# EAGLE design th-lora (EAGLE 6.5.0)
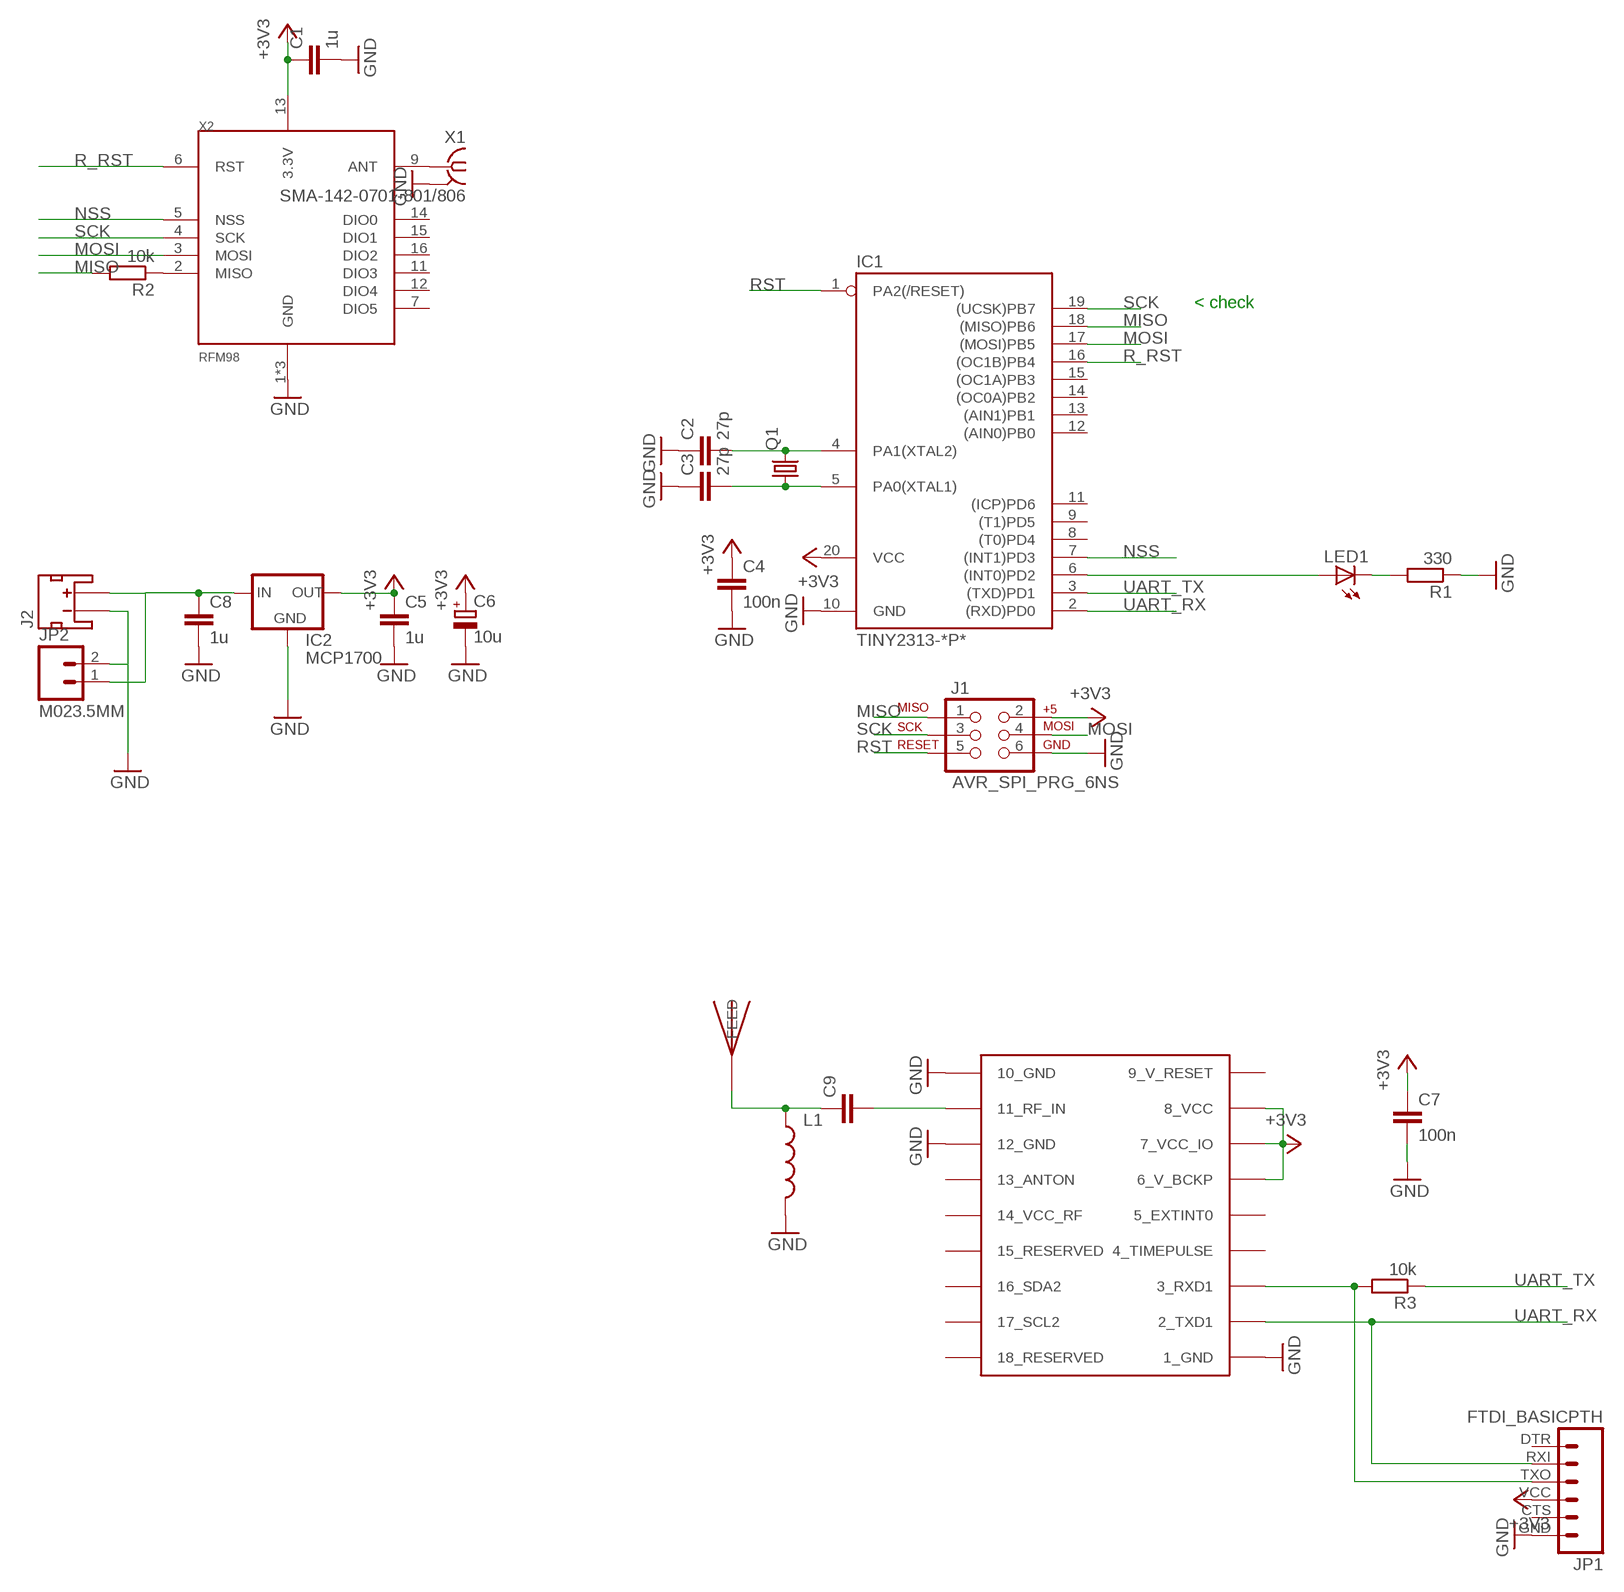
[diagram p0: schematic, sheet 1]

## Parts
C1  1u  C-EU050-025X075  [C050-025X075]
C2  27p  C-EU050-025X075  [C050-025X075]
C3  27p  C-EU050-025X075  [C050-025X075]
C4  100n  C-EU050-025X075  [C050-025X075]
C5  1u  C-EU050-025X075  [C050-025X075]
C6  10u  CPOL-EUE2.5-5  [E2,5-5]
C7  100n  C-EU050-025X075  [C050-025X075]
C8  1u  C-EU050-025X075  [C050-025X075]
C9  C-EUC0603  [C0603]
IC1  TINY2313-*P*  [DIL20]
IC2  MCP1700  [TO92-INLINE]
J1  AVR_SPI_PRG_6NS  [2X3-NS]
J2  JST_2MM_MALE  [JST-2-SMD]
JP1  FTDI_BASICPTH  [FTDI_BASIC]
JP2  M023.5MM  [SCREWTERMINAL-3.5MM-2]
L1  INDUCTOR0603  [0603]
LED1  LED3MM  [LED3MM]
Q1  CRYSTALHC49S  [HC49/S]
R1  330  R-EU_0204/7  [0204/7]
R2  10k  R-EU_0204/7  [0204/7]
R3  10k  R-EU_0204/7  [0204/7]
U$3  JTI_ANTENNA-1575AT43A40  [JTI_ANTENNA-1575AT43A40]
X1  SMA-142-0701-801/806  [J502-ND-142-0701-801/806]
X2  RFM98  [RFM97]
X3  UBLOX_MAX  [UBLOX_MAX]

## Nets
+3V3: C1.1 C4.1 C5.1 C6.+ C7.1 IC1.20(VCC) IC2.VOUT(OUT) J1.2 JP1.VCC X2.13(3.3V) X3.6_V_BCKP X3.7_VCC_IO X3.8_VCC
GND: C1.2 C2.1 C3.1 C4.2 C5.2 C6.- C7.2 C8.2 IC1.10(GND) IC2.GND J1.6 J2.1(-) JP1.GND JP2.2 L1.2 R1.1 X1.G@1 X1.G@2 X1.G@3 X1.G@4 X2.1(GND) X2.8(GND) X2.10(GND) X3.1_GND X3.10_GND X3.12_GND
MISO: IC1.18((MISO)PB6) J1.1 R2.2
MOSI: IC1.17((MOSI)PB5) J1.4 X2.3(MOSI)
N$1: C9.2 X3.11_RF_IN
N$2: X1.1 X2.9(ANT)
N$3: LED1.K(C) R1.2
N$4: C9.1 L1.1 U$3.FEED
N$6: C2.2 IC1.4(PA1(XTAL2)) Q1.2
N$7: C3.2 IC1.5(PA0(XTAL1)) Q1.1
N$11: C8.1 IC2.VIN(IN) J2.2(+) JP2.1
N$12: IC1.6((INT0)PD2) LED1.A
N$13: JP1.TXO R3.2 X3.3_RXD1
N$14: R2.1 X2.2(MISO)
NSS: IC1.7((INT1)PD3) X2.5(NSS)
R_RST: IC1.16((OC1B)PB4) X2.6(RST)
RST: IC1.1(PA2(/RESET)) J1.5
SCK: IC1.19((UCSK)PB7) J1.3 X2.4(SCK)
UART_RX: IC1.2((RXD)PD0) JP1.RXI X3.2_TXD1
UART_TX: IC1.3((TXD)PD1) R3.1
Unconnected: IC1.8((T0)PD4) IC1.9((T1)PD5) IC1.11((ICP)PD6) IC1.12((AIN0)PB0) IC1.13((AIN1)PB1) IC1.14((OC0A)PB2) IC1.15((OC1A)PB3) J2.NC1(PAD1) J2.NC2(PAD2) JP1.CTS JP1.DTR X2.7(DIO5) X2.11(DIO3) X2.12(DIO4) X2.14(DIO0) X2.15(DIO1) X2.16(DIO2) X3.4_TIMEPULSE X3.5_EXTINT0 X3.13_ANTON X3.14_VCC_RF X3.15_RESERVED X3.16_SDA2 X3.17_SCL2 X3.18_RESERVED

## Notes on the sheet
- < check

## Power pins joined to a net without a drawn wire
9_V_RESET: X3.9_V_RESET

## Library data of the parts
C1-C5 C7-C9 = rcl:C-EU: CAPACITOR, European symbol
C6 = rcl:CPOL-EU: POLARIZED CAPACITOR, European symbol
IC1 = avr-7:TINY2313*: Atmel Tiny2313 2K Flash, 128 bytes EEPROM, 128 bytes RAM
IC2 = dtb:MCP1700
J1 = SparkFun-Connectors:AVR_SPI_PRG_6: AVR ISP 6 Pin This is the reduced ISP connector for AVR programming. Common on Arduino. This footprint will take up less PCB space and can be used with a 10-pin to 6-pin adapter such as SKU: BOB-08508
J2 = dtb:JST_2MM_MALE: Mates to single-cell LiPo batteries. CONN-08352; PROD_ID: CONN-08352
JP1 = SparkFun-Connectors:FTDI_BASIC: FTDI Basic header with labels
JP2 = SparkFun-Connectors:M02: Standard 2-pin 0.1" header. Use with - straight break away headers ( PRT-00116) - right angle break away headers (PRT-00553) - swiss pins (PRT-00743) - machine pins (PRT-00117) - female headers (PRT-00115) Molex polarized connector foot print use with: PRT-08233 with associated crimp pins and housings. 2.54_SCREWTERM for use with PRT-10571. 3.5mm Screw Terminal footprints for PRT-08084 5mm Screw Terminal footprints for use with PRT-08433
L1 = SparkFun-Passives:INDUCTOR: Inductors Basic Inductor/Choke - 0603 and 1206. Footprints are not proven and vary greatly between part numbers. SRN6045- 33uH, 20% 1.4A SDR0403-560KL - 56uH, 10%, 500mA RMS/740mA peak
LED1 = dtb:LED: LED OSRAM: - CHIPLED LG R971, LG N971, LY N971, LG Q971, LY Q971, LO R971, LY R971 LH N974, LH R974 LS Q976, LO Q976, LY Q976 LO Q996 - Hyper CHIPLED LW Q18S LB Q993, LB Q99A, LB R99A - SideLED LS A670, LO A670, LY A670, LG A670, LP A670 LB A673, LV A673, LT A673, LW A673 LH A674 LY A675 LS A676, LA A676, LO A676, LY A676, LW A676 LS A679, LY A679, LG A679 - Hyper Micro SIDELED® LS Y876, LA Y876, LO Y876, LY Y876 LT Y87S - SmartLED LW L88C, LW L88S LB L89C, LB L89S, LG L890 LS L89K, LO L89K, LY L89K LS L896, LA L896, LO L896, LY L896 - TOPLED LS T670, LO T670, LY T670, LG T670, LP T670 LSG T670, LSP T670, LSY T670, LOP T670, LYG T670 LG T671, LOG T671, LSG T671 LB T673, LV T673, LT T673, LW T673 LH T674 LS T676, LA T676, LO T676, LY T676, LB T676, LH T676, LSB T676, LW T676 LB T67C, LV T67C, LT T67C, LS T67K, LO T67K, LY T67K, LW E67C LS E67B, LA E67B, LO E67B, LY E67B, LB E67C, LV E67C, LT E67C LW T67C LS T679, LY T679, LG T679 LS T770, LO T770, LY T770, LG T770, LP T770 LB T773, LV T773, LT T773, LW T773 LH T774 LS E675, LA E675, LY E675, LS T675 LS T776, LA T776, LO T776, LY T776, LB T776 LHGB T686 LT T68C, LB T68C - Hyper Mini TOPLED® LB M676 - Mini TOPLED Santana® LG M470 LS M47K, LO M47K, LY M47K Source: http://www.osram.convergy.de LUXEON: - LUMILED® LXK2-PW12-R00, LXK2-PW12-S00, LXK2-PW14-U00, LXK2-PW14-V00 LXK2-PM12-R00, LXK2-PM12-S00, LXK2-PM14-U00 LXK2-PE12-Q00, LXK2-PE12-R00, LXK2-PE12-S00, LXK2-PE14-T00, LXK2-PE14-U00 LXK2-PB12-K00, LXK2-PB12-L00, LXK2-PB12-M00, LXK2-PB14-N00, LXK2-PB14-P00, LXK2-PB14-Q00 LXK2-PR12-L00, LXK2-PR12-M00, LXK2-PR14-Q00, LXK2-PR14-R00 LXK2-PD12-Q00, LXK2-PD12-R00, LXK2-PD12-S00 LXK2-PH12-R00, LXK2-PH12-S00 LXK2-PL12-P00, LXK2-PL12-Q00, LXK2-PL12-R00 Source: www.luxeon.com KINGBRIGHT: KA-3528ASYC Source: www.kingbright.com
Q1 = crystal:CRYSTAL: CRYSTAL; OC_FARNELL: 1667008; OC_NEWARK: unknown
R1-R3 = rcl:R-EU_: RESISTOR, European symbol
U$3 = Ava:JTI_ANTENNA-1575AT43A40
X1 = con-coax:SMA-: SMA 50 Ohm End Launch Jack Receptacle - Round Contact Johnson Components Source: www.johnsoncomponents.com .. J502-ND.pdf; MF: JOHNSON COMPONENTS; MPN: 142-0701-801; OC_FARNELL: 1608592; OC_NEWARK: 90F2624
X2 = Mine:RFM98
X3 = Ava:UBLOX_MAX: UBLOX MAX

## Board
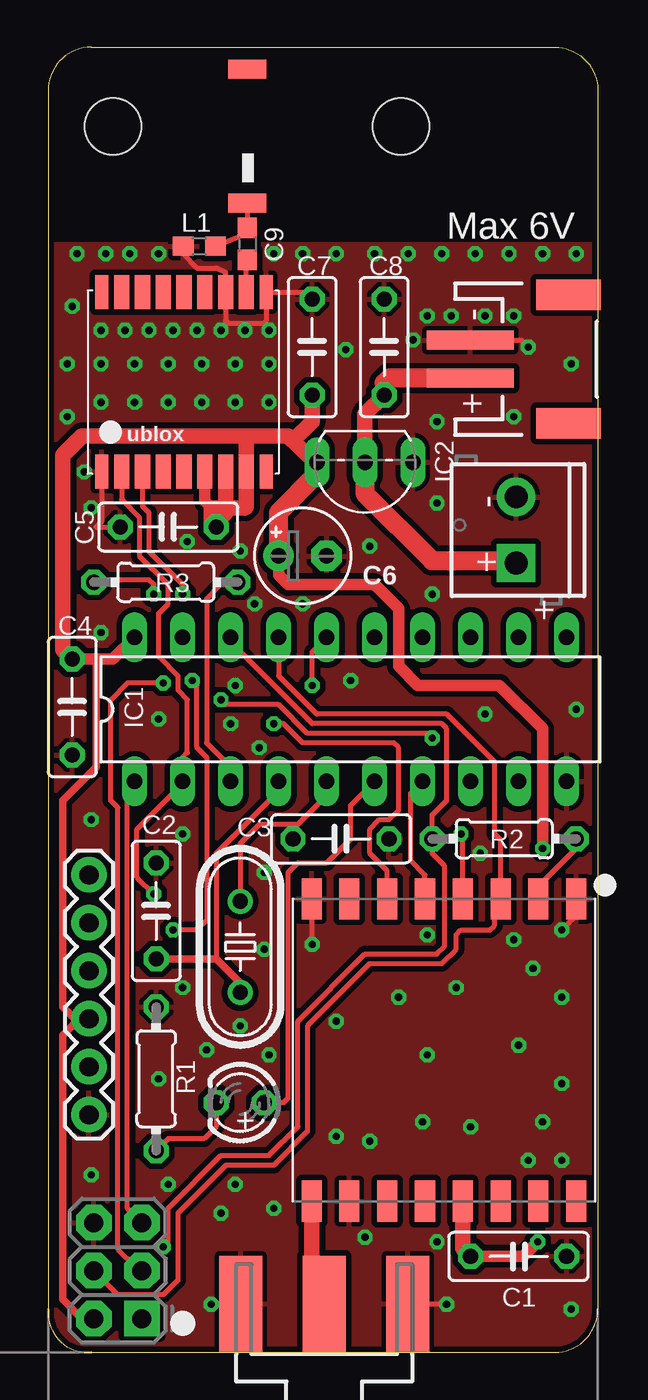
[diagram p1: board, top side]
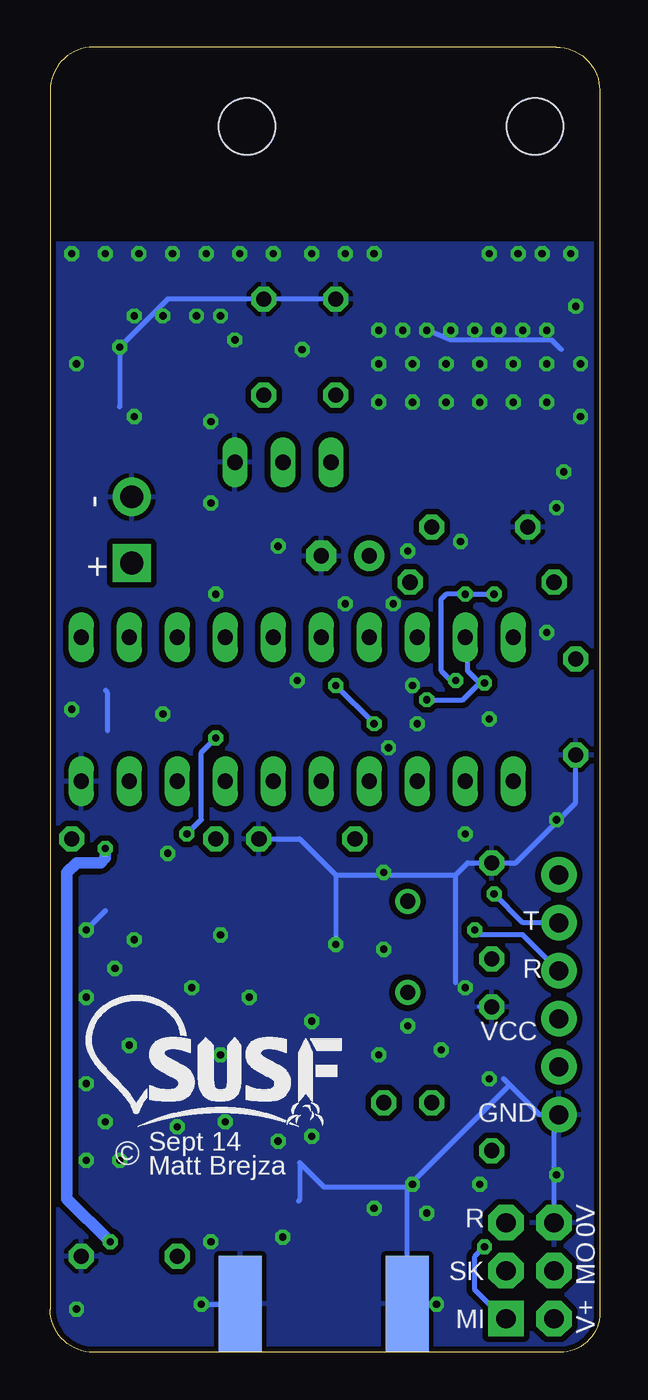
[diagram p2: board, bottom side, seen from below]

Size 29.09 x 69.09 mm. Coordinates in mm from the lower left corner, seen from the top.
Outline: 1.91,0 26.81,0 arc90 29.09,2.29 29.09,66.8 arc90 26.81,69.09 2.29,69.09 arc90 0.01,66.8 0.01,2.29 arc90 1.91,0
Copper layers (1*16): Top 0.035mm / dielectric 1.5mm / Bottom 0.035mm
Design rules "default *": minimum track width 8mil, minimum drill 15mil, track to track 8mil, track to pad 8mil, pad to pad 6mil, via to via 8mil, smd to smd 6mil, copper to edge 10mil, drill to drill 8mil, minimum pad ring 10mil, minimum via ring 8mil, stop-mask expansion 4mil, vias tented up to drill 15mil, thermal gap 10mil
Holes 3 mm at 18.68,64.9 3.44,64.9

### Footprints (pad centres in the part's own frame; a part is rotated, then mirrored left to right if it is on the bottom)
C050-025X075 = drill 0.813 octagon: 1 -2.54,0; 2 2.54,0
E2,5-5 = drill 0.813 pad 1.6: + -1.27,0 | drill 0.813 pad 1.6 octagon: - 1.27,0
C0603 = smd 1.1 x 1: 1 -0.85,0; 2 0.85,0
DIL20 = drill 0.813 long: 1 -11.43,-3.81; 2 -8.89,-3.81; 3 -6.35,-3.81; 4 -3.81,-3.81; 5 -1.27,-3.81; 6 1.27,-3.81; 7 3.81,-3.81; 8 6.35,-3.81; 9 8.89,-3.81; 10 11.43,-3.81; 11 11.43,3.81; 12 8.89,3.81; 13 6.35,3.81; 14 3.81,3.81; 15 1.27,3.81; 16 -1.27,3.81; 17 -3.81,3.81; 18 -6.35,3.81; 19 -8.89,3.81; 20 -11.43,3.81
TO92-INLINE = drill 0.813 long: GND -2.54,0; VIN 0,0; VOUT 2.54,0
2X3-NS = drill 1.016 pad 1.88 square: 1 -2.54,-1.27 | drill 1.016 pad 1.88 octagon: 2 -2.54,1.27; 3 0,-1.27; 4 0,1.27; 5 2.54,-1.27; 6 2.54,1.27
JST-2-SMD = smd 1 x 4.6: 1 -1,-3.7; 2 1,-3.7 | smd 1.6 x 3.4: NC1 -3.4,1.5; NC2 3.4,1.5
FTDI_BASIC = drill 1.016 pad 1.88: CTS 10.16,0; DTR 0,0; GND 12.7,0; RXI 2.54,0; TXO 5.08,0; VCC 7.62,0
SCREWTERMINAL-3.5MM-2 = drill 1.2 pad 2.032 square: 1 0,0 | drill 1.2 pad 2.032: 2 3.5,0
0603 = smd 1.1 x 1: 1 -0.85,0; 2 0.85,0
LED3MM = drill 0.813 octagon: A -1.27,0; K 1.27,0
HC49/S = drill 0.813: 1 -2.413,0; 2 2.413,0
0204/7 = drill 0.813 octagon: 1 -3.81,0; 2 3.81,0
JTI_ANTENNA-1575AT43A40 = smd 1 x 2: FEED -3.175,0; NC 3.925,0
J502-ND-142-0701-801/806 = smd 5.08 x 2.286: 1 2.565,0; G@1 2.565,4.42; G@2 2.565,-4.42 | smd 5.08 x 2.286 bottom: G@3 2.565,4.42; G@4 2.565,-4.42
RFM97 = smd 2.184 x 1.067: 1 0,0; 2 0,-2; 3 0,-4; 4 0,-6; 5 0,-8; 6 0,-10; 7 0,-12; 8 0,-14; 9 16,-14; 10 16,-12; 11 16,-10; 12 16,-8; 13 16,-6; 14 16,-4; 15 16,-2; 16 16,0
UBLOX_MAX = smd 1.8 x 0.7: 1_GND 4.95,-4.4; 9_V_RESET 4.95,4.3; 10_GND -4.55,4.3; 18_RESERVED -4.55,-4.4 | smd 1.8 x 0.8: 2_TXD1 4.95,-3.35; 3_RXD1 4.95,-2.25; 4_TIMEPULSE 4.95,-1.15; 5_EXTINT0 4.95,-0.05; 6_V_BCKP 4.95,1.05; 7_VCC_IO 4.95,2.15; 8_VCC 4.95,3.25; 11_RF_IN -4.55,3.25; 12_GND -4.55,2.15; 13_ANTON -4.55,1.05; 14_VCC_RF -4.55,-0.05; 15_RESERVED -4.55,-1.15; 16_SDA2 -4.55,-2.25; 17_SCL2 -4.55,-3.35

### Placement (x,y rotation side)
C1  24.9,5.08 0 top
C2  5.72,23.37 270 top
C3  15.5,27.18 180 top
C4  1.28,34.16 270 top
C5  6.36,43.69 180 top
C6  13.47,42.16 0 top
C7  13.98,53.21 90 top
C8  17.79,53.21 90 top
C9  10.55,58.67 270 top
IC1  16.01,34.04 0 top
IC2  16.77,47.12 180 top
J1  3.69,4.32 90 top
J2  26.04,52.58 270 top
JP1  2.17,25.27 270 top
JP2  24.77,41.78 90 top
L1  8.01,58.55 180 top
LED1  10.17,13.21 180 top
Q1  10.17,21.46 270 top
R1  5.72,14.48 270 top
R2  24.14,27.18 180 top
R3  6.23,40.77 180 top
U$3  10.55,64.01 90 top
U$4  [SUSF-XSM]  27.19,11.94 0 bottom
X1  14.61,0 90 top
X2  27.95,24 270 top
X3  7.25,51.56 270 top

### Tracks (layer width: path | path; a pad name or v marks a point on that pad's centre or on a via)
+3V3  (via drill 0.38)
  Top 0.406: J1.2 1.79,1.78 0.77,2.79 0.77,16.76 1.53,17.53 2.04,17.53 JP1.VCC 1.41,17.65 0.77,18.29 0.77,29.21 2.55,30.99 2.55,36.7
  Top 0.61: IC1.20 3.44,36.7 2.55,36.7 C4.1 1.02,36.96 | v26.17,26.67 26.17,33.02 23.88,35.31 19.57,35.31 18.55,36.32 18.55,39.37 17.28,40.64 12.71,40.64 12.2,41.15 C6.+ | X3.6_V_BCKP 8.3,45.05 8.64,44.7 | v25.92,5.84 25.15,5.08 C1.1
  Top 0.813: X2.13 21.95,5.49 C1.1 | IC2.VOUT 14.11,47.12 12.96,48.26 | 12.96,48.26 12.71,48.51 10.42,48.51 | 10.42,48.51 1.79,48.51 0.77,47.5 0.77,37.21 C4.1 | X3.7_VCC_IO 9.41,44.45 8.9,43.94 C5.1 8.64,43.94 8.64,44.7 10.42,44.7 10.5,44.78 X3.8_VCC 10.5,48.44 10.42,48.51 | C7.1 13.98,49.28 12.96,48.26
  Top 1.016: C6.+ 12.2,44.45 14.23,46.48 IC2.VOUT
  Bottom 0.61: v26.17,26.67 26.17,26.16 26.42,25.91 27.69,25.91 28.2,25.4 28.2,8.13 v25.92,5.84
GND  (via drill 0.38)
  Top 0.254: 13.98,21.46 v13.98,21.59 13.98,23.97 X2.8 | 15.95,7.43 15.95,7.49 15.88,7.56 15.88,8.76 15.95,8.7 | 18.42,4.95 18.42,3.17 X1.G@4 21.07,2.56 v21.09,2.54 | J2.1 25.04,53.58 v25.41,53.21 | X3.12_GND 9.4,54.62 9.53,54.48 11.44,54.48 11.55,54.59 X3.10_GND 13.62,56.11 C7.2 | L1.2 7.16,58.13 7.88,57.4 8.9,57.4 9.4,57.16 X3.12_GND | X3.12_GND 9.4,54.36 v9.15,54.1 | X2.1 27.95,23.11 v27.19,22.35 | v8.64,2.54 10.17,2.54 X1.G@3 | X3.1_GND 2.85,43.99 2.55,43.69 C5.2
  Bottom 0.254: C4.2 1.28,29.08 4.45,25.91 C2.1 6.99,25.91 7.63,25.27 | C3.1 15.88,27.18 13.98,25.27 | 13.98,25.27 v13.98,21.59 13.98,21.46 | R1.1 6.36,18.29 | 7.63,19.56 7.63,25.27 | 13.98,25.27 7.63,25.27 | 4.77,14.16 3.18,12.57 JP1.GND 2.42,12.32 J1.6 | 4.77,14.16 5.09,14.48 | 10.19,8.74 X1.G@3 8.67,2.56 v8.64,2.54 | 10.19,8.74 4.77,14.16 | 10.19,8.74 14.59,8.74 15.88,10.03 15.88,8.07 X2.10 | 25.41,50.04 v25.41,53.21 22.87,55.75 C8.2 C7.2 | 26.17,23.37 v27.19,22.35 | v21.09,2.54 19.06,2.54 X1.G@4 | 2.04,53.09 2.55,53.59 7.88,53.59 v9.15,54.1 | 26.04,32.89 26.04,34.92 26.17,35.05
  Bottom 0.61: 27.31,30.1 IC1.10
  other vias: 5.85,58.17 4.33,58.17 3.06,58.17 1.53,58.17 11.95,58.17 13.47,58.17 15.25,58.17 17.28,58.17 19.06,58.17 20.84,58.17 22.61,58.17 20.07,54.86 21.34,54.86 19.31,53.59 24.65,54.86 23.12,54.86 16.01,35.56 9.91,35.31 11.18,32 23.12,33.78 27.95,34.04 21.6,19.3 24.65,21.84 27.19,18.8 27.19,10.16 25.41,10.16 17.03,11.18 11.95,7.62 16.77,6.1 20.58,5.84 9.15,7.37 6.36,8.89 2.29,9.4 8.39,16 7.12,19.3 7.12,27.43 2.29,28.19 5.85,33.53 11.69,50.29 11.69,54.1 10.42,54.1 2.8,54.1 4.07,54.1 5.34,54.1 6.61,54.1 7.88,54.1 11.69,52.32 9.91,50.29 8.14,50.29 6.36,50.29 4.58,50.29 4.58,52.32 6.36,52.32 8.14,52.32 9.91,52.32 1.28,55.37 2.8,52.32 2.8,50.29 24.65,49.53 27.69,52.32 9.66,33.27 18.55,18.8 27.19,14.22 20.07,22.1 11.69,15.75 5.85,14.48 22.87,26.42 11.44,25.4 11.44,21.34 10.17,17.27 2.8,38.1 1.02,49.53 20.07,15.75 24.9,16.26 15.25,17.53 15.25,11.43 9.91,8.89 19.82,12.19 27.69,2.29 1.02,52.32 24.39,58.17 26.17,58.17 27.95,58.17 13.47,39.62 10.93,39.62 10.17,42.42 7.37,42.93 2.29,44.7 17.03,42.67 20.58,44.96 20.33,40.13 20.58,49.28 15.76,53.09 1.91,46.61 26.17,12.19 25.66,20.32 22.36,11.94
  pour Bottom (isolate 0.305): -0.25,58.67 30.23,58.67 30.23,-1.02 -0.75,-1.02
  pour Top (isolate 0.305): -0.5,58.67 29.73,58.67 29.73,0 -1.01,0
MISO  (via drill 0.38)
  Top 0.254: 9.66,38.61 IC1.18 9.66,37.59 13.98,33.27 20.84,33.27 21.09,33.02 21.09,29.21 20.33,28.45 R2.2 20.33,26.42 20.96,25.78 20.96,21.46 20.58,21.08 16.77,21.08 13.22,17.53 13.22,11.94 11.69,10.41 9.15,10.41 6.36,7.62 6.36,5.84 v6.1,5.59
  Bottom 0.254: J1.1 5.09,1.78 6.61,3.3 6.61,5.08 v6.1,5.59
MOSI
  Top 0.254: X2.3 23.95,23.56 | J1.4 3.69,3.05 6.1,3.05 6.87,3.81 6.87,7.37 9.41,9.91 11.95,9.91 13.72,11.68 13.72,17.27 17.03,20.57 20.84,20.57 21.6,21.34 21.6,22.1 21.85,22.35 23.38,22.35 23.63,22.61 23.63,23.68 X2.3 | X2.3 23.95,27.11 23.63,27.43 23.63,31.24 21.09,33.78 14.23,33.78 12.2,35.81 IC1.17
N$1
  Top 0.254: X3.11_RF_IN 10.5,57.77 C9.2
N$2
  Top 0.813: X2.9 13.95,2.32 14.49,1.78 14.49,2.44 X1.1
N$3
  Top 0.254: LED1.K 8.9,11.94 8.26,11.3 6.36,11.3 R1.2
N$4
  Top 0.254: U$3.FEED C9.1 10.08,59.05 L1.1
N$6
  Top 0.254: IC1.4 12.2,29.72 8.9,26.42 8.9,20.83
  Top 0.406: Q1.2 10.17,19.56 8.9,20.83 C2.2
N$7
  Top 0.254: IC1.5 14.74,29.46 13.22,27.94 12.96,27.94 | C3.2 12.96,27.94 | 12.96,27.94 11.18,27.94 10.17,26.92 Q1.1
N$11
  Top 0.813: IC2.VIN 16.77,49.66 C8.1
  Top 1.016: J2.2 18.06,51.58 17.79,51.31 C8.1 | IC2.VIN 16.77,45.47 20.33,41.91 24.65,41.91 JP2.1
N$12
  Top 0.254: IC1.6 16.01,28.96 16.01,27.18 14.74,25.91 13.22,25.91 12.71,25.4 12.71,13.46 12.45,13.21 LED1.A
N$13  (via drill 0.38)
  Top 0.254: v6.61,22.35 7.88,22.35 8.39,22.86 8.39,31.5 7.88,32 7.88,35.31 v7.63,35.56 | X3.3_RXD1 5,44.8 5.34,44.45 5.34,42.42 7.12,40.64 v7.12,40.13 | v5.6,40.13 5.6,40.64 5.34,40.89 2.55,40.89 R3.2
  Bottom 0.254: JP1.TXO 4.07,22.1 6.36,22.1 v6.61,22.35 | v7.63,35.56 7.88,35.56 8.39,36.07 8.39,39.88 8.14,40.13 v7.12,40.13 v5.6,40.13
N$14
  Top 0.254: R2.1 27.95,26.67 26.17,24.89 26.17,24.22 X2.2
NSS
  Top 0.254: X2.5 19.95,25.27 19.19,26.04 19.19,29.59 IC1.7
R_RST  (via drill 0.38)
  Top 0.254: X2.6 17.95,25.49 17.03,26.42 17.03,27.69 17.53,28.19 18.04,28.19 18.55,28.7 18.55,32 18.3,32.26 13.47,32.26 12.45,33.27 v11.95,33.27 | v13.98,35.31 13.98,37.08 IC1.16
  Bottom 0.254: v11.95,33.27 v13.98,35.31
RST
  Top 0.254: 4.96,7.24 J1.5 4.2,7.62 4.2,29.84 IC1.1
SCK  (via drill 0.38)
  Top 0.254: 4.96,4.45 J1.3 4.71,4.57 4.58,4.57 3.69,5.46 3.69,28.83 3.31,29.21 3.31,34.54 4.2,35.43 v6.1,35.43 | X2.4 21.95,27.34 v21.85,27.43 | v20.33,32.51 20.07,32.77 13.72,32.77 12.2,34.29 9.41,34.29 v9.15,34.54
  Bottom 0.254: v6.1,35.43 6.36,35.43 | 6.36,35.43 6.99,36.07 6.99,37.72 IC1.19 | v21.85,27.43 21.09,28.19 21.09,31.75 v20.33,32.51 | v9.15,34.54 7.25,34.54 6.36,35.43
UART_RX  (via drill 0.38)
  Top 0.254: v5.6,24.26 4.71,25.15 4.71,27.69 7.12,30.1 IC1.2 7.12,31.5 7.37,31.75 7.37,34.54 6.87,35.05 6.87,35.81 5.85,36.83 5.85,39.12 6.36,39.62 6.36,40.64 4.83,42.16 4.83,44.2 3.9,45.13 X3.2_TXD1
  Bottom 0.254: JP1.RXI 4.07,22.73 v5.6,24.26
UART_TX
  Top 0.254: IC1.3 9.66,30.99 8.39,32.26 8.39,39.88 9.15,40.64 9.91,40.64 R3.1

### Text on the board
tPlace: Max 6V | - | + | - | + | +
bPlace: - | + | T | R | VCC | GND | Sept 14 | © | Matt Brejza | 0V | R | SK | MO | V+ | MI